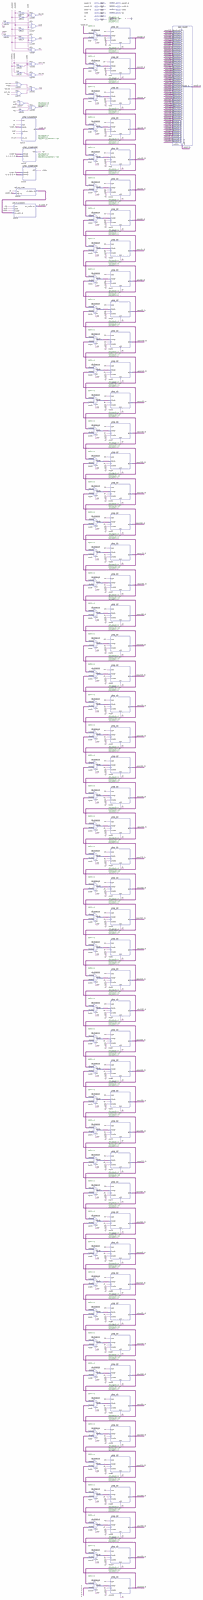
[diagram p0: schematic sheet, whole]
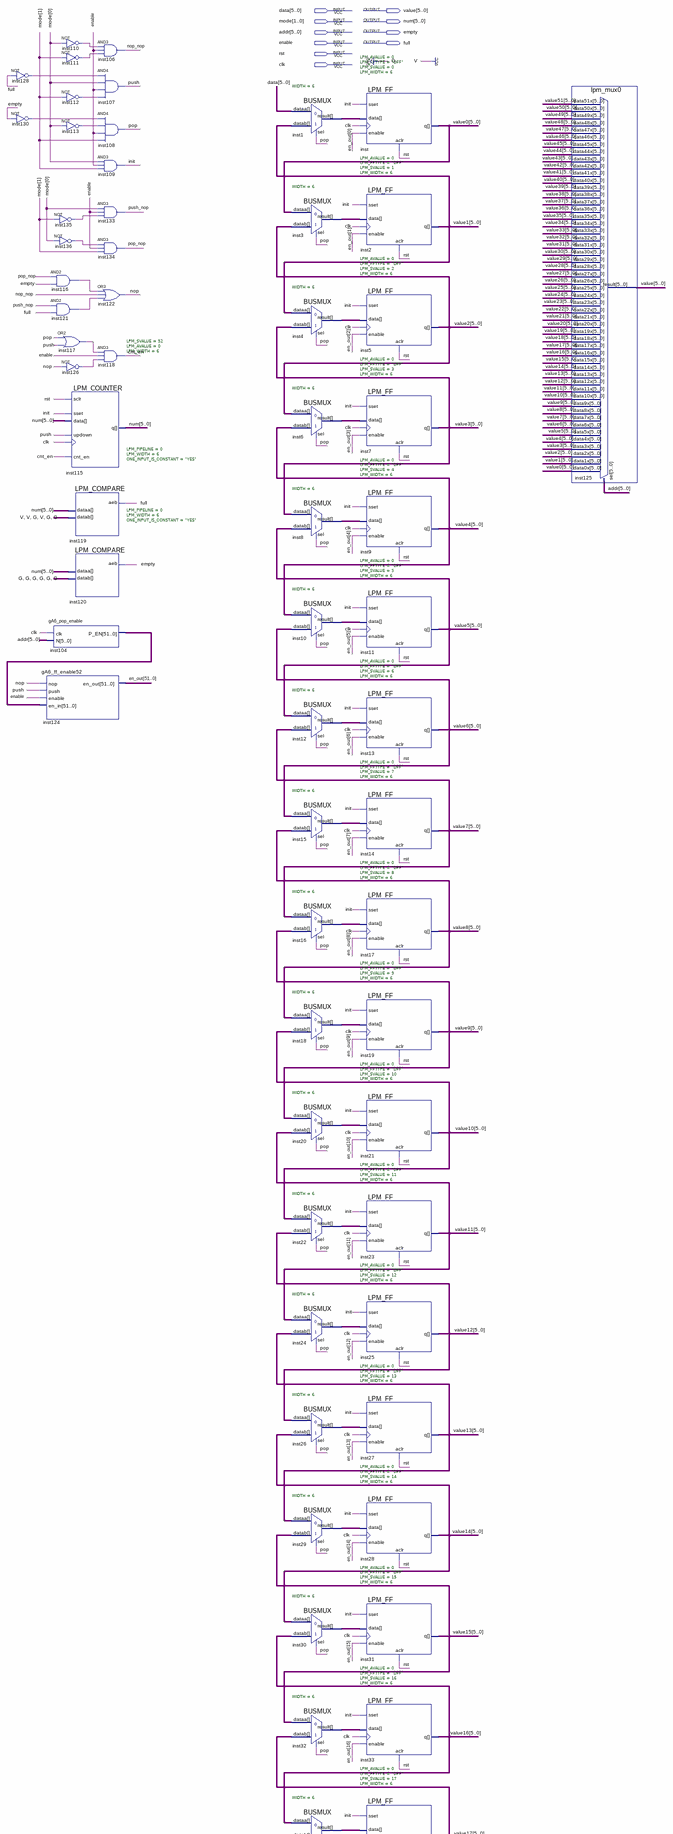
[diagram p1: schematic sheet, upper part]
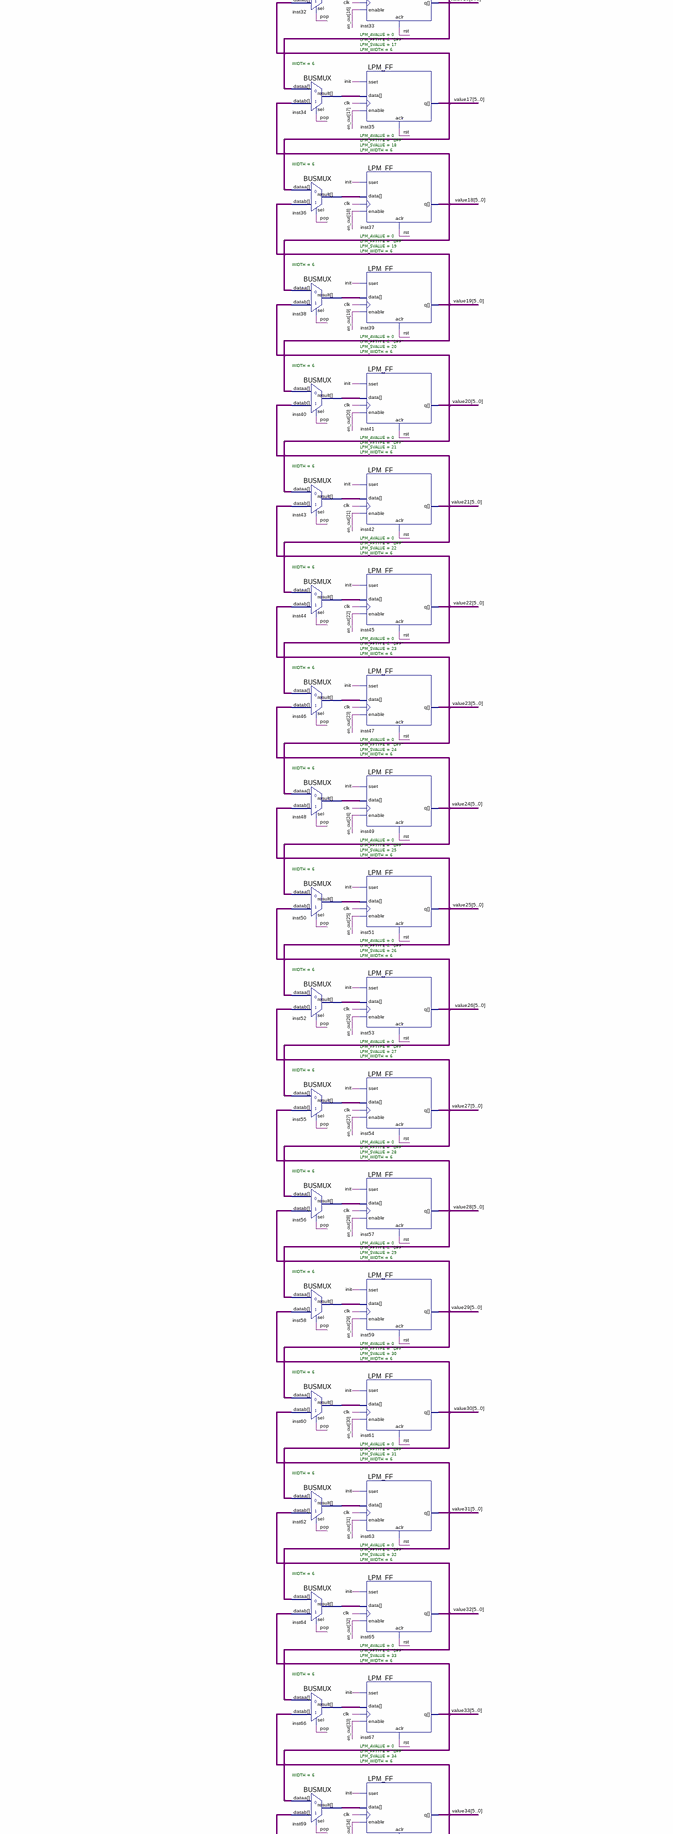
[diagram p2: schematic sheet, middle part]
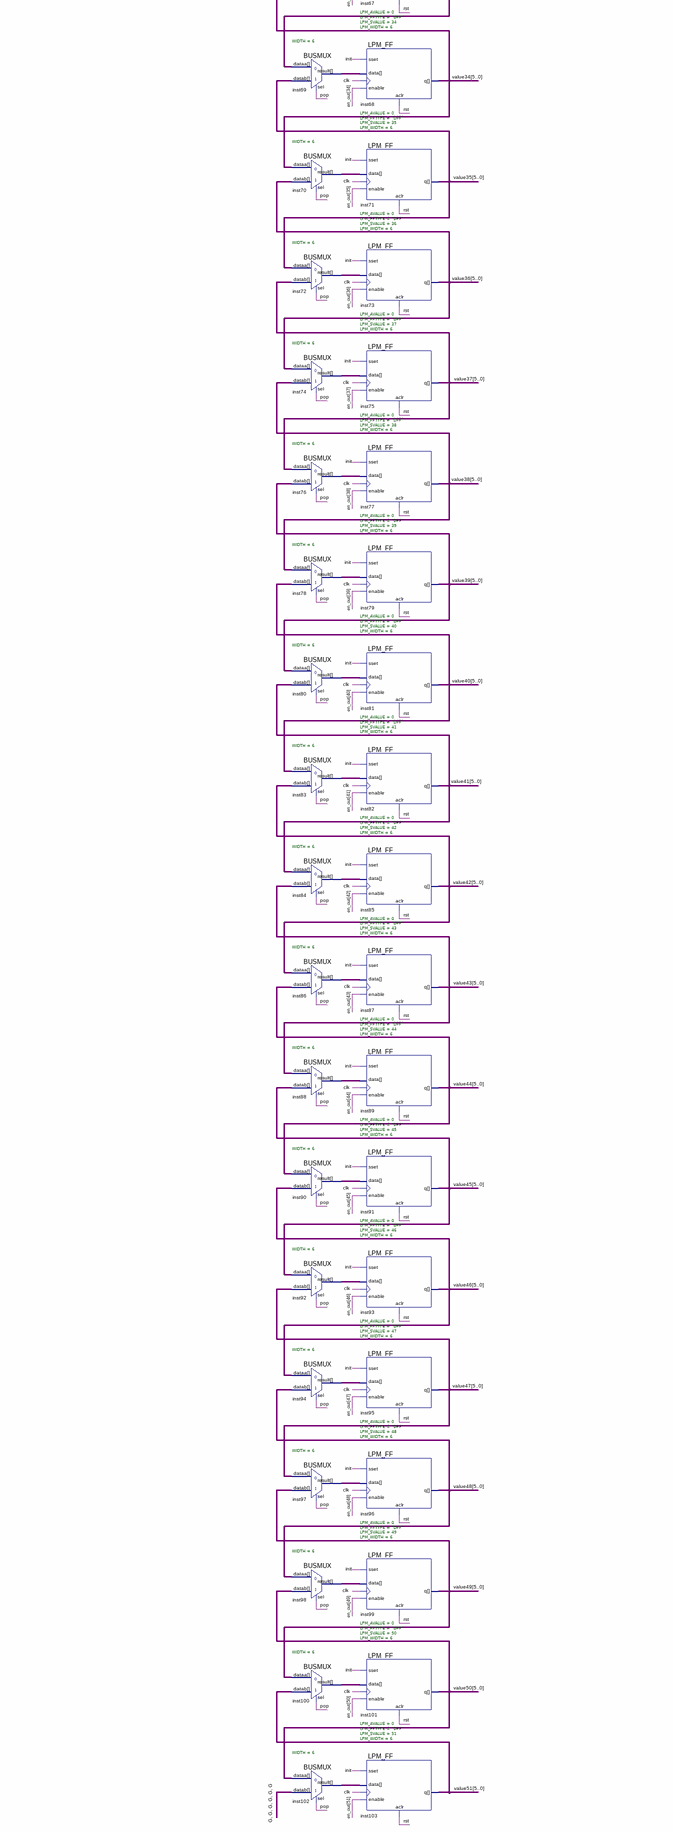
[diagram p3: schematic sheet, lower part]
// Quartus schematic gA6_stack52.bdf as structural Verilog: 130 symbols, 10 pins
module gA6_stack52 (
  input  [5:0] data,
  input  [1:0] mode,
  input  [5:0] addr,
  input  enable,
  input  rst,
  input  clk,
  output [5:0] value,
  output [5:0] num,
  output empty,
  output full
);

  wire cnt_en, init, inst110_out, inst111_out, inst112_out, inst113_out, inst116_out, inst117_out,
       inst121_out, inst126_out, inst128_out, inst130_out, inst135_out, inst136_out, nop, nop_nop, pop,
       pop_nop, push, push_nop;
  wire [5:0] inst1_result, inst3_result, inst4_result, inst6_result, inst8_result, inst10_result,
       inst12_result, inst15_result, inst16_result, inst18_result, inst20_result, inst22_result,
       inst24_result, inst26_result, inst29_result, inst30_result, inst32_result, inst34_result,
       inst36_result, inst38_result, inst40_result, inst43_result, inst44_result, inst46_result,
       inst48_result, inst50_result, inst52_result, inst55_result, inst56_result, inst58_result,
       inst60_result, inst62_result, inst64_result, inst66_result, inst69_result, inst70_result,
       inst72_result, inst74_result, inst76_result, inst78_result, inst80_result, inst83_result,
       inst84_result, inst86_result, inst88_result, inst90_result, inst92_result, inst94_result,
       inst97_result, inst98_result, inst100_result, inst102_result, value0, value1, value2, value3, value4,
       value5, value6, value7, value8, value9, value10, value11, value12, value13, value14, value15, value16,
       value17, value18, value19, value20, value21, value22, value23, value24, value25, value26, value27,
       value28, value29, value30, value31, value32, value33, value34, value35, value36, value37, value38,
       value39, value40, value41, value42, value43, value44, value45, value46, value47, value48, value49,
       value50, value51;
  wire [51:0] en_out, inst104_p_en;

  not inst128 (inst128_out, full);
  not inst130 (inst130_out, empty);
  not inst110 (inst110_out, mode[0]);
  not inst111 (inst111_out, mode[1]);
  not inst112 (inst112_out, mode[1]);
  not inst113 (inst113_out, mode[0]);
  not inst135 (inst135_out, mode[1]);
  not inst136 (inst136_out, mode[0]);
  and inst116 (inst116_out, pop_nop, empty);
  and inst121 (inst121_out, push_nop, full);
  or inst117 (inst117_out, pop, push);
  not inst126 (inst126_out, nop);
  LPM_COUNTER #(.LPM_SVALUE(52), .LPM_AVALUE(0), .LPM_WIDTH(6)) inst115 (
    .clock(clk), .cnt_en(cnt_en), .data(num), .sclr(rst), .sset(init), .updown(push), .q(num));
  gA6_pop_enable inst104 (.clk(clk), .N(addr), .P_EN(inst104_p_en));
  gA6_ff_enable52 inst124 (.nop(nop), .push(push), .enable(enable), .en_in(inst104_p_en), .en_out(en_out));
  LPM_COMPARE #(.LPM_PIPELINE(0), .LPM_WIDTH(6), .ONE_INPUT_IS_CONSTANT("YES")) inst119 (
    .dataa(num), .datab(6'b110100), .aeb(full));
  LPM_COMPARE #(.LPM_PIPELINE(0), .LPM_WIDTH(6), .ONE_INPUT_IS_CONSTANT("YES")) inst120 (
    .dataa(num), .datab({6{1'b0}}), .aeb(empty));
  and inst106 (nop_nop, inst110_out, enable, inst111_out);
  and inst107 (push, inst128_out, mode[0], enable, inst112_out);
  and inst108 (pop, inst130_out, inst113_out, enable, mode[1]);
  and inst109 (init, mode[0], enable, mode[1]);
  and inst133 (push_nop, mode[0], enable, inst135_out);
  and inst134 (pop_nop, inst136_out, enable, mode[1]);
  or inst122 (nop, inst116_out, nop_nop, inst121_out);
  and inst118 (cnt_en, inst117_out, enable, inst126_out);
  BUSMUX #(.WIDTH(6)) inst1 (.datab(value1), .sel(pop), .dataa(data), .result(inst1_result));
  BUSMUX #(.WIDTH(6)) inst3 (.datab(value2), .sel(pop), .dataa(value0), .result(inst3_result));
  BUSMUX #(.WIDTH(6)) inst4 (.datab(value3), .sel(pop), .dataa(value1), .result(inst4_result));
  BUSMUX #(.WIDTH(6)) inst6 (.datab(value4), .sel(pop), .dataa(value2), .result(inst6_result));
  BUSMUX #(.WIDTH(6)) inst8 (.datab(value5), .sel(pop), .dataa(value3), .result(inst8_result));
  BUSMUX #(.WIDTH(6)) inst10 (.datab(value6), .sel(pop), .dataa(value4), .result(inst10_result));
  BUSMUX #(.WIDTH(6)) inst12 (.datab(value7), .sel(pop), .dataa(value5), .result(inst12_result));
  BUSMUX #(.WIDTH(6)) inst15 (.datab(value8), .sel(pop), .dataa(value6), .result(inst15_result));
  BUSMUX #(.WIDTH(6)) inst16 (.datab(value9), .sel(pop), .dataa(value7), .result(inst16_result));
  BUSMUX #(.WIDTH(6)) inst18 (.datab(value10), .sel(pop), .dataa(value8), .result(inst18_result));
  BUSMUX #(.WIDTH(6)) inst20 (.datab(value11), .sel(pop), .dataa(value9), .result(inst20_result));
  BUSMUX #(.WIDTH(6)) inst22 (.datab(value12), .sel(pop), .dataa(value10), .result(inst22_result));
  BUSMUX #(.WIDTH(6)) inst24 (.datab(value13), .sel(pop), .dataa(value11), .result(inst24_result));
  BUSMUX #(.WIDTH(6)) inst26 (.datab(value14), .sel(pop), .dataa(value12), .result(inst26_result));
  BUSMUX #(.WIDTH(6)) inst29 (.datab(value15), .sel(pop), .dataa(value13), .result(inst29_result));
  BUSMUX #(.WIDTH(6)) inst30 (.datab(value16), .sel(pop), .dataa(value14), .result(inst30_result));
  BUSMUX #(.WIDTH(6)) inst32 (.datab(value17), .sel(pop), .dataa(value15), .result(inst32_result));
  BUSMUX #(.WIDTH(6)) inst34 (.datab(value18), .sel(pop), .dataa(value16), .result(inst34_result));
  BUSMUX #(.WIDTH(6)) inst36 (.datab(value19), .sel(pop), .dataa(value17), .result(inst36_result));
  BUSMUX #(.WIDTH(6)) inst38 (.datab(value20), .sel(pop), .dataa(value18), .result(inst38_result));
  BUSMUX #(.WIDTH(6)) inst40 (.datab(value21), .sel(pop), .dataa(value19), .result(inst40_result));
  BUSMUX #(.WIDTH(6)) inst43 (.datab(value22), .sel(pop), .dataa(value20), .result(inst43_result));
  BUSMUX #(.WIDTH(6)) inst44 (.datab(value23), .sel(pop), .dataa(value21), .result(inst44_result));
  BUSMUX #(.WIDTH(6)) inst46 (.datab(value24), .sel(pop), .dataa(value22), .result(inst46_result));
  BUSMUX #(.WIDTH(6)) inst48 (.datab(value25), .sel(pop), .dataa(value23), .result(inst48_result));
  BUSMUX #(.WIDTH(6)) inst50 (.datab(value26), .sel(pop), .dataa(value24), .result(inst50_result));
  BUSMUX #(.WIDTH(6)) inst52 (.datab(value27), .sel(pop), .dataa(value25), .result(inst52_result));
  BUSMUX #(.WIDTH(6)) inst55 (.datab(value28), .sel(pop), .dataa(value26), .result(inst55_result));
  BUSMUX #(.WIDTH(6)) inst56 (.datab(value29), .sel(pop), .dataa(value27), .result(inst56_result));
  BUSMUX #(.WIDTH(6)) inst58 (.datab(value30), .sel(pop), .dataa(value28), .result(inst58_result));
  BUSMUX #(.WIDTH(6)) inst60 (.datab(value31), .sel(pop), .dataa(value29), .result(inst60_result));
  BUSMUX #(.WIDTH(6)) inst62 (.datab(value32), .sel(pop), .dataa(value30), .result(inst62_result));
  BUSMUX #(.WIDTH(6)) inst64 (.datab(value33), .sel(pop), .dataa(value31), .result(inst64_result));
  BUSMUX #(.WIDTH(6)) inst66 (.datab(value34), .sel(pop), .dataa(value32), .result(inst66_result));
  BUSMUX #(.WIDTH(6)) inst69 (.datab(value35), .sel(pop), .dataa(value33), .result(inst69_result));
  BUSMUX #(.WIDTH(6)) inst70 (.datab(value36), .sel(pop), .dataa(value34), .result(inst70_result));
  BUSMUX #(.WIDTH(6)) inst72 (.datab(value37), .sel(pop), .dataa(value35), .result(inst72_result));
  BUSMUX #(.WIDTH(6)) inst74 (.datab(value38), .sel(pop), .dataa(value36), .result(inst74_result));
  BUSMUX #(.WIDTH(6)) inst76 (.datab(value39), .sel(pop), .dataa(value37), .result(inst76_result));
  BUSMUX #(.WIDTH(6)) inst78 (.datab(value40), .sel(pop), .dataa(value38), .result(inst78_result));
  BUSMUX #(.WIDTH(6)) inst80 (.datab(value41), .sel(pop), .dataa(value39), .result(inst80_result));
  BUSMUX #(.WIDTH(6)) inst83 (.datab(value42), .sel(pop), .dataa(value40), .result(inst83_result));
  BUSMUX #(.WIDTH(6)) inst84 (.datab(value43), .sel(pop), .dataa(value41), .result(inst84_result));
  BUSMUX #(.WIDTH(6)) inst86 (.datab(value44), .sel(pop), .dataa(value42), .result(inst86_result));
  BUSMUX #(.WIDTH(6)) inst88 (.datab(value45), .sel(pop), .dataa(value43), .result(inst88_result));
  BUSMUX #(.WIDTH(6)) inst90 (.datab(value46), .sel(pop), .dataa(value44), .result(inst90_result));
  BUSMUX #(.WIDTH(6)) inst92 (.datab(value47), .sel(pop), .dataa(value45), .result(inst92_result));
  BUSMUX #(.WIDTH(6)) inst94 (.datab(value48), .sel(pop), .dataa(value46), .result(inst94_result));
  BUSMUX #(.WIDTH(6)) inst97 (.datab(value49), .sel(pop), .dataa(value47), .result(inst97_result));
  BUSMUX #(.WIDTH(6)) inst98 (.datab(value50), .sel(pop), .dataa(value48), .result(inst98_result));
  BUSMUX #(.WIDTH(6)) inst100 (.datab(value51), .sel(pop), .dataa(value49), .result(inst100_result));
  BUSMUX #(.WIDTH(6)) inst102 (.datab({6{1'b0}}), .sel(pop), .dataa(value50), .result(inst102_result));
  LPM_FF #(.LPM_AVALUE(0), .LPM_FFTYPE("DFF"), .LPM_SVALUE(0), .LPM_WIDTH(6)) inst (
    .aclr(rst), .clock(clk), .data(inst1_result), .enable(en_out[0]), .sset(init), .q(value0));
  LPM_FF #(.LPM_AVALUE(0), .LPM_FFTYPE("DFF"), .LPM_SVALUE(1), .LPM_WIDTH(6)) inst2 (
    .aclr(rst), .clock(clk), .data(inst3_result), .enable(en_out[1]), .sset(init), .q(value1));
  LPM_FF #(.LPM_AVALUE(0), .LPM_FFTYPE("DFF"), .LPM_SVALUE(2), .LPM_WIDTH(6)) inst5 (
    .aclr(rst), .clock(clk), .data(inst4_result), .enable(en_out[2]), .sset(init), .q(value2));
  LPM_FF #(.LPM_AVALUE(0), .LPM_FFTYPE("DFF"), .LPM_SVALUE(3), .LPM_WIDTH(6)) inst7 (
    .aclr(rst), .clock(clk), .data(inst6_result), .enable(en_out[3]), .sset(init), .q(value3));
  LPM_FF #(.LPM_AVALUE(0), .LPM_FFTYPE("DFF"), .LPM_SVALUE(4), .LPM_WIDTH(6)) inst9 (
    .aclr(rst), .clock(clk), .data(inst8_result), .enable(en_out[4]), .sset(init), .q(value4));
  LPM_FF #(.LPM_AVALUE(0), .LPM_FFTYPE("DFF"), .LPM_SVALUE(5), .LPM_WIDTH(6)) inst11 (
    .aclr(rst), .clock(clk), .data(inst10_result), .enable(en_out[5]), .sset(init), .q(value5));
  LPM_FF #(.LPM_AVALUE(0), .LPM_FFTYPE("DFF"), .LPM_SVALUE(6), .LPM_WIDTH(6)) inst13 (
    .aclr(rst), .clock(clk), .data(inst12_result), .enable(en_out[6]), .sset(init), .q(value6));
  LPM_FF #(.LPM_AVALUE(0), .LPM_FFTYPE("DFF"), .LPM_SVALUE(7), .LPM_WIDTH(6)) inst14 (
    .aclr(rst), .clock(clk), .data(inst15_result), .enable(en_out[7]), .sset(init), .q(value7));
  LPM_FF #(.LPM_AVALUE(0), .LPM_FFTYPE("DFF"), .LPM_SVALUE(8), .LPM_WIDTH(6)) inst17 (
    .aclr(rst), .clock(clk), .data(inst16_result), .enable(en_out[8]), .sset(init), .q(value8));
  LPM_FF #(.LPM_AVALUE(0), .LPM_FFTYPE("DFF"), .LPM_SVALUE(9), .LPM_WIDTH(6)) inst19 (
    .aclr(rst), .clock(clk), .data(inst18_result), .enable(en_out[9]), .sset(init), .q(value9));
  LPM_FF #(.LPM_AVALUE(0), .LPM_FFTYPE("DFF"), .LPM_SVALUE(10), .LPM_WIDTH(6)) inst21 (
    .aclr(rst), .clock(clk), .data(inst20_result), .enable(en_out[10]), .sset(init), .q(value10));
  LPM_FF #(.LPM_AVALUE(0), .LPM_FFTYPE("DFF"), .LPM_SVALUE(11), .LPM_WIDTH(6)) inst23 (
    .aclr(rst), .clock(clk), .data(inst22_result), .enable(en_out[11]), .sset(init), .q(value11));
  LPM_FF #(.LPM_AVALUE(0), .LPM_FFTYPE("DFF"), .LPM_SVALUE(12), .LPM_WIDTH(6)) inst25 (
    .aclr(rst), .clock(clk), .data(inst24_result), .enable(en_out[12]), .sset(init), .q(value12));
  LPM_FF #(.LPM_AVALUE(0), .LPM_FFTYPE("DFF"), .LPM_SVALUE(13), .LPM_WIDTH(6)) inst27 (
    .aclr(rst), .clock(clk), .data(inst26_result), .enable(en_out[13]), .sset(init), .q(value13));
  LPM_FF #(.LPM_AVALUE(0), .LPM_FFTYPE("DFF"), .LPM_SVALUE(14), .LPM_WIDTH(6)) inst28 (
    .aclr(rst), .clock(clk), .data(inst29_result), .enable(en_out[14]), .sset(init), .q(value14));
  LPM_FF #(.LPM_AVALUE(0), .LPM_FFTYPE("DFF"), .LPM_SVALUE(15), .LPM_WIDTH(6)) inst31 (
    .aclr(rst), .clock(clk), .data(inst30_result), .enable(en_out[15]), .sset(init), .q(value15));
  LPM_FF #(.LPM_AVALUE(0), .LPM_FFTYPE("DFF"), .LPM_SVALUE(16), .LPM_WIDTH(6)) inst33 (
    .aclr(rst), .clock(clk), .data(inst32_result), .enable(en_out[16]), .sset(init), .q(value16));
  LPM_FF #(.LPM_AVALUE(0), .LPM_FFTYPE("DFF"), .LPM_SVALUE(17), .LPM_WIDTH(6)) inst35 (
    .aclr(rst), .clock(clk), .data(inst34_result), .enable(en_out[17]), .sset(init), .q(value17));
  LPM_FF #(.LPM_AVALUE(0), .LPM_FFTYPE("DFF"), .LPM_SVALUE(18), .LPM_WIDTH(6)) inst37 (
    .aclr(rst), .clock(clk), .data(inst36_result), .enable(en_out[18]), .sset(init), .q(value18));
  LPM_FF #(.LPM_AVALUE(0), .LPM_FFTYPE("DFF"), .LPM_SVALUE(19), .LPM_WIDTH(6)) inst39 (
    .aclr(rst), .clock(clk), .data(inst38_result), .enable(en_out[19]), .sset(init), .q(value19));
  LPM_FF #(.LPM_AVALUE(0), .LPM_FFTYPE("DFF"), .LPM_SVALUE(20), .LPM_WIDTH(6)) inst41 (
    .aclr(rst), .clock(clk), .data(inst40_result), .enable(en_out[20]), .sset(init), .q(value20));
  LPM_FF #(.LPM_AVALUE(0), .LPM_FFTYPE("DFF"), .LPM_SVALUE(21), .LPM_WIDTH(6)) inst42 (
    .aclr(rst), .clock(clk), .data(inst43_result), .enable(en_out[21]), .sset(init), .q(value21));
  LPM_FF #(.LPM_AVALUE(0), .LPM_FFTYPE("DFF"), .LPM_SVALUE(22), .LPM_WIDTH(6)) inst45 (
    .aclr(rst), .clock(clk), .data(inst44_result), .enable(en_out[22]), .sset(init), .q(value22));
  LPM_FF #(.LPM_AVALUE(0), .LPM_FFTYPE("DFF"), .LPM_SVALUE(23), .LPM_WIDTH(6)) inst47 (
    .aclr(rst), .clock(clk), .data(inst46_result), .enable(en_out[23]), .sset(init), .q(value23));
  LPM_FF #(.LPM_AVALUE(0), .LPM_FFTYPE("DFF"), .LPM_SVALUE(24), .LPM_WIDTH(6)) inst49 (
    .aclr(rst), .clock(clk), .data(inst48_result), .enable(en_out[24]), .sset(init), .q(value24));
  LPM_FF #(.LPM_AVALUE(0), .LPM_FFTYPE("DFF"), .LPM_SVALUE(25), .LPM_WIDTH(6)) inst51 (
    .aclr(rst), .clock(clk), .data(inst50_result), .enable(en_out[25]), .sset(init), .q(value25));
  LPM_FF #(.LPM_AVALUE(0), .LPM_FFTYPE("DFF"), .LPM_SVALUE(26), .LPM_WIDTH(6)) inst53 (
    .aclr(rst), .clock(clk), .data(inst52_result), .enable(en_out[26]), .sset(init), .q(value26));
  LPM_FF #(.LPM_AVALUE(0), .LPM_FFTYPE("DFF"), .LPM_SVALUE(27), .LPM_WIDTH(6)) inst54 (
    .aclr(rst), .clock(clk), .data(inst55_result), .enable(en_out[27]), .sset(init), .q(value27));
  LPM_FF #(.LPM_AVALUE(0), .LPM_FFTYPE("DFF"), .LPM_SVALUE(28), .LPM_WIDTH(6)) inst57 (
    .aclr(rst), .clock(clk), .data(inst56_result), .enable(en_out[28]), .sset(init), .q(value28));
  LPM_FF #(.LPM_AVALUE(0), .LPM_FFTYPE("DFF"), .LPM_SVALUE(29), .LPM_WIDTH(6)) inst59 (
    .aclr(rst), .clock(clk), .data(inst58_result), .enable(en_out[29]), .sset(init), .q(value29));
  LPM_FF #(.LPM_AVALUE(0), .LPM_FFTYPE("DFF"), .LPM_SVALUE(30), .LPM_WIDTH(6)) inst61 (
    .aclr(rst), .clock(clk), .data(inst60_result), .enable(en_out[30]), .sset(init), .q(value30));
  LPM_FF #(.LPM_AVALUE(0), .LPM_FFTYPE("DFF"), .LPM_SVALUE(31), .LPM_WIDTH(6)) inst63 (
    .aclr(rst), .clock(clk), .data(inst62_result), .enable(en_out[31]), .sset(init), .q(value31));
  LPM_FF #(.LPM_AVALUE(0), .LPM_FFTYPE("DFF"), .LPM_SVALUE(32), .LPM_WIDTH(6)) inst65 (
    .aclr(rst), .clock(clk), .data(inst64_result), .enable(en_out[32]), .sset(init), .q(value32));
  LPM_FF #(.LPM_AVALUE(0), .LPM_FFTYPE("DFF"), .LPM_SVALUE(33), .LPM_WIDTH(6)) inst67 (
    .aclr(rst), .clock(clk), .data(inst66_result), .enable(en_out[33]), .sset(init), .q(value33));
  LPM_FF #(.LPM_AVALUE(0), .LPM_FFTYPE("DFF"), .LPM_SVALUE(34), .LPM_WIDTH(6)) inst68 (
    .aclr(rst), .clock(clk), .data(inst69_result), .enable(en_out[34]), .sset(init), .q(value34));
  LPM_FF #(.LPM_AVALUE(0), .LPM_FFTYPE("DFF"), .LPM_SVALUE(35), .LPM_WIDTH(6)) inst71 (
    .aclr(rst), .clock(clk), .data(inst70_result), .enable(en_out[35]), .sset(init), .q(value35));
  LPM_FF #(.LPM_AVALUE(0), .LPM_FFTYPE("DFF"), .LPM_SVALUE(36), .LPM_WIDTH(6)) inst73 (
    .aclr(rst), .clock(clk), .data(inst72_result), .enable(en_out[36]), .sset(init), .q(value36));
  LPM_FF #(.LPM_AVALUE(0), .LPM_FFTYPE("DFF"), .LPM_SVALUE(37), .LPM_WIDTH(6)) inst75 (
    .aclr(rst), .clock(clk), .data(inst74_result), .enable(en_out[37]), .sset(init), .q(value37));
  LPM_FF #(.LPM_AVALUE(0), .LPM_FFTYPE("DFF"), .LPM_SVALUE(38), .LPM_WIDTH(6)) inst77 (
    .aclr(rst), .clock(clk), .data(inst76_result), .enable(en_out[38]), .sset(init), .q(value38));
  LPM_FF #(.LPM_AVALUE(0), .LPM_FFTYPE("DFF"), .LPM_SVALUE(39), .LPM_WIDTH(6)) inst79 (
    .aclr(rst), .clock(clk), .data(inst78_result), .enable(en_out[39]), .sset(init), .q(value39));
  LPM_FF #(.LPM_AVALUE(0), .LPM_FFTYPE("DFF"), .LPM_SVALUE(40), .LPM_WIDTH(6)) inst81 (
    .aclr(rst), .clock(clk), .data(inst80_result), .enable(en_out[40]), .sset(init), .q(value40));
  LPM_FF #(.LPM_AVALUE(0), .LPM_FFTYPE("DFF"), .LPM_SVALUE(41), .LPM_WIDTH(6)) inst82 (
    .aclr(rst), .clock(clk), .data(inst83_result), .enable(en_out[41]), .sset(init), .q(value41));
  LPM_FF #(.LPM_AVALUE(0), .LPM_FFTYPE("DFF"), .LPM_SVALUE(42), .LPM_WIDTH(6)) inst85 (
    .aclr(rst), .clock(clk), .data(inst84_result), .enable(en_out[42]), .sset(init), .q(value42));
  LPM_FF #(.LPM_AVALUE(0), .LPM_FFTYPE("DFF"), .LPM_SVALUE(43), .LPM_WIDTH(6)) inst87 (
    .aclr(rst), .clock(clk), .data(inst86_result), .enable(en_out[43]), .sset(init), .q(value43));
  LPM_FF #(.LPM_AVALUE(0), .LPM_FFTYPE("DFF"), .LPM_SVALUE(44), .LPM_WIDTH(6)) inst89 (
    .aclr(rst), .clock(clk), .data(inst88_result), .enable(en_out[44]), .sset(init), .q(value44));
  LPM_FF #(.LPM_AVALUE(0), .LPM_FFTYPE("DFF"), .LPM_SVALUE(45), .LPM_WIDTH(6)) inst91 (
    .aclr(rst), .clock(clk), .data(inst90_result), .enable(en_out[45]), .sset(init), .q(value45));
  LPM_FF #(.LPM_AVALUE(0), .LPM_FFTYPE("DFF"), .LPM_SVALUE(46), .LPM_WIDTH(6)) inst93 (
    .aclr(rst), .clock(clk), .data(inst92_result), .enable(en_out[46]), .sset(init), .q(value46));
  LPM_FF #(.LPM_AVALUE(0), .LPM_FFTYPE("DFF"), .LPM_SVALUE(47), .LPM_WIDTH(6)) inst95 (
    .aclr(rst), .clock(clk), .data(inst94_result), .enable(en_out[47]), .sset(init), .q(value47));
  LPM_FF #(.LPM_AVALUE(0), .LPM_FFTYPE("DFF"), .LPM_SVALUE(48), .LPM_WIDTH(6)) inst96 (
    .aclr(rst), .clock(clk), .data(inst97_result), .enable(en_out[48]), .sset(init), .q(value48));
  LPM_FF #(.LPM_AVALUE(0), .LPM_FFTYPE("DFF"), .LPM_SVALUE(49), .LPM_WIDTH(6)) inst99 (
    .aclr(rst), .clock(clk), .data(inst98_result), .enable(en_out[49]), .sset(init), .q(value49));
  LPM_FF #(.LPM_AVALUE(0), .LPM_FFTYPE("DFF"), .LPM_SVALUE(50), .LPM_WIDTH(6)) inst101 (
    .aclr(rst), .clock(clk), .data(inst100_result), .enable(en_out[50]), .sset(init), .q(value50));
  LPM_FF #(.LPM_AVALUE(0), .LPM_FFTYPE("DFF"), .LPM_SVALUE(51), .LPM_WIDTH(6)) inst103 (
    .aclr(rst), .clock(clk), .data(inst102_result), .enable(en_out[51]), .sset(init), .q(value51));
  lpm_mux0 inst125 (
    .data51x(value51), .data50x(value50), .data49x(value49), .data48x(value48), .data47x(value47),
    .data46x(value46), .data45x(value45), .data44x(value44), .data43x(value43), .data42x(value42),
    .data41x(value41), .data40x(value40), .data39x(value39), .data38x(value38), .data37x(value37),
    .data36x(value36), .data35x(value35), .data34x(value34), .data33x(value33), .data32x(value32),
    .data31x(value31), .data30x(value30), .data29x(value29), .data28x(value28), .data27x(value27),
    .data26x(value26), .data25x(value25), .data24x(value24), .data23x(value23), .data22x(value22),
    .data21x(value21), .data20x(value20), .data19x(value19), .data18x(value18), .data17x(value17),
    .data16x(value16), .data15x(value15), .data14x(value14), .data13x(value13), .data12x(value12),
    .data11x(value11), .data10x(value10), .data9x(value9), .data8x(value8), .data7x(value7), .data6x(value6),
    .data5x(value5), .data4x(value4), .data3x(value3), .data2x(value2), .data1x(value1), .data0x(value0),
    .sel(addr), .result(value));
endmodule
